# Altium project Logic_RF.PrjPcb
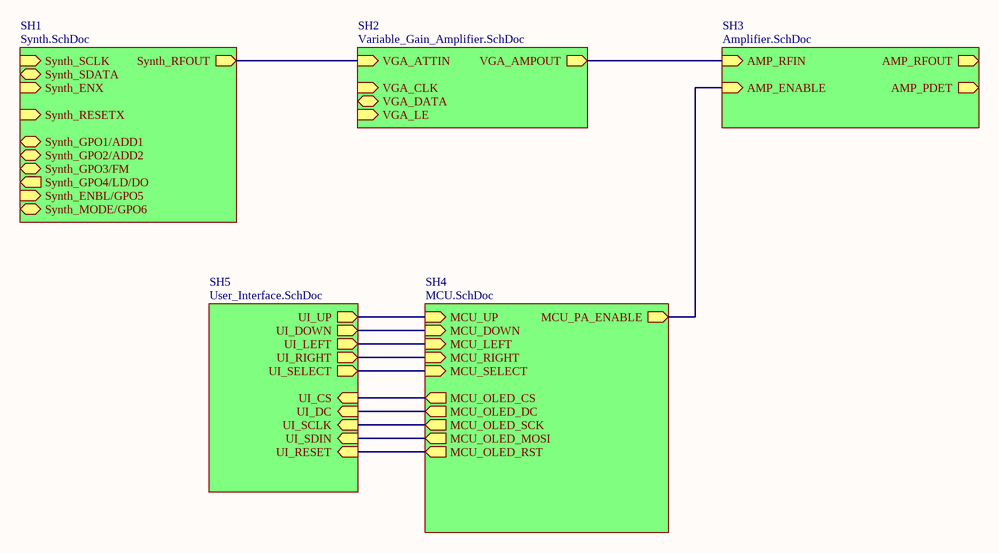
[diagram p0: Top_Level.SchDoc]
5 sheets, 72 parts. Net scope: hierarchical (ports join the sheet entries above them; power ports are global).
Board file: Logic_RF.PcbDoc
Sheets:
  Top_Level.SchDoc
    SH1 = Synth.SchDoc
    SH2 = Variable_Gain_Amplifier.SchDoc
    SH3 = Amplifier.SchDoc
    SH4 = MCU.SchDoc

## Sheet Top_Level.SchDoc: AusBubble : Logic & RF : Top Level
size A4; DrawnBy: WR, ND; DocumentNumber: 1; Revision: A; SheetNumber: 1; SheetTotal: 6

### Sub-sheets
SH1 = Synth.SchDoc: Synth_RESETX (in), Synth_ENX (in), Synth_SCLK (in), Synth_SDATA, Synth_ENBL/GPO5 (in), Synth_GPO4/LD/DO (out), Synth_RFOUT (out), Synth_GPO3/FM (bidir), Synth_GPO1/ADD1 (bidir), Synth_GPO2/ADD2 (bidir), Synth_MODE/GPO6 (bidir)
SH2 = Variable_Gain_Amplifier.SchDoc: VGA_AMPOUT (out), VGA_CLK (in), VGA_DATA, VGA_LE (in), VGA_ATTIN (in)
SH3 = Amplifier.SchDoc: AMP_RFIN (in), AMP_RFOUT (out), AMP_ENABLE (in), AMP_PDET (out)
SH4 = MCU.SchDoc: MCU_UP (in), MCU_DOWN (in), MCU_LEFT (in), MCU_RIGHT (in), MCU_SELECT (in), MCU_PA_ENABLE (out), MCU_OLED_CS (out), MCU_OLED_DC (out), MCU_OLED_RST (out), MCU_OLED_SCK (out), MCU_OLED_MOSI (out)
SH5 = User_Interface.SchDoc (file not in this document): UI_CS (in), UI_DC (in), UI_SCLK (in), UI_SDIN (in), UI_RESET (in), UI_UP (out), UI_DOWN (out), UI_LEFT (out), UI_RIGHT (out), UI_SELECT (out)

### Nets
NetC13_2: sheet SH1/Synth_RFOUT, sheet SH2/VGA_ATTIN
NetC23_1: sheet SH2/VGA_AMPOUT, sheet SH3/AMP_RFIN
NetQ1_2: sheet SH4/MCU_SELECT, sheet SH5/UI_SELECT
NetR19_2: sheet SH3/AMP_ENABLE, sheet SH4/MCU_PA_ENABLE
NetU1_16: sheet SH4/MCU_OLED_DC, sheet SH5/UI_DC
NetU1_17: sheet SH4/MCU_OLED_RST, sheet SH5/UI_RESET
NetU1_20: sheet SH4/MCU_OLED_CS, sheet SH5/UI_CS
NetU1_21: sheet SH4/MCU_OLED_SCK, sheet SH5/UI_SCLK
NetU1_23: sheet SH4/MCU_OLED_MOSI, sheet SH5/UI_SDIN
NetU1_51: sheet SH4/MCU_DOWN, sheet SH5/UI_DOWN
NetU1_52: sheet SH4/MCU_UP, sheet SH5/UI_UP
NetU1_53: sheet SH4/MCU_RIGHT, sheet SH5/UI_RIGHT
NetU1_54: sheet SH4/MCU_LEFT, sheet SH5/UI_LEFT

## Sheet Synth.SchDoc
size A4; DocumentNumber: 3; SheetNumber: 3; SheetTotal: 5
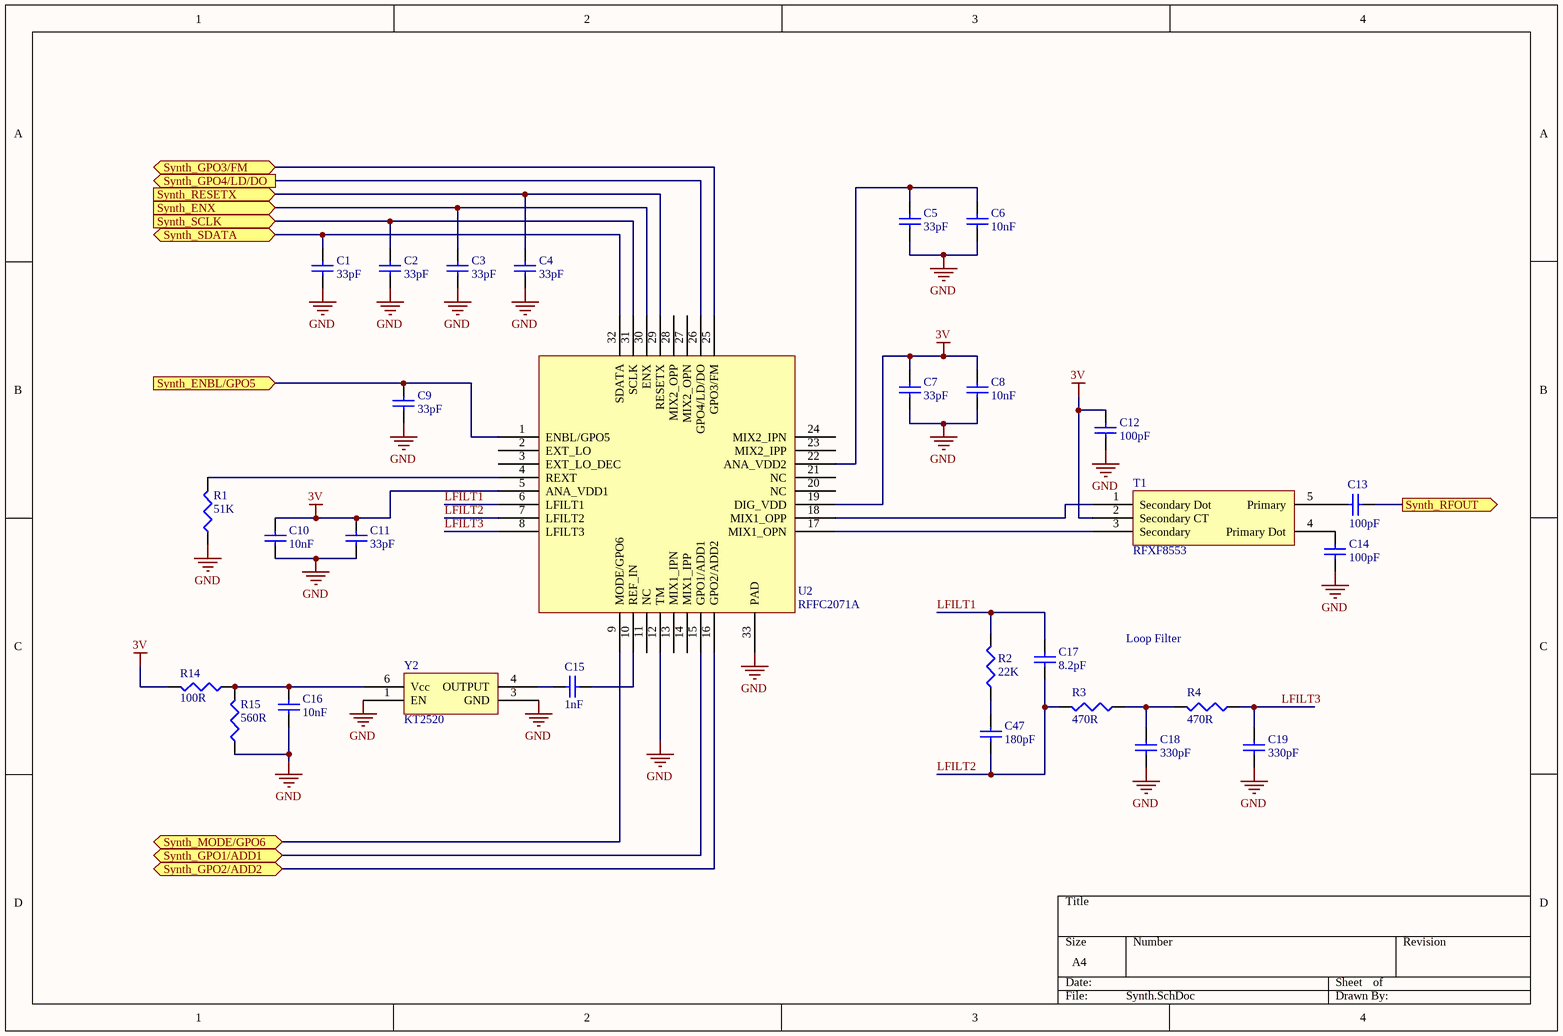
[diagram p1: Synth.SchDoc]

### Parts
C1  value 33pF  [1608[0603]]  (hidden comment: Cap Semi)
C2  value 33pF  [1608[0603]]  (hidden comment: Cap Semi)
C3  value 33pF  [1608[0603]]  (hidden comment: Cap Semi)
C4  value 33pF  [1608[0603]]  (hidden comment: Cap Semi)
C5  value 33pF  [1608[0603]]  (hidden comment: Cap Semi)
C6  value 10nF  [1608[0603]]  (hidden comment: Cap Semi)
C7  value 33pF  [1608[0603]]  (hidden comment: Cap Semi)
C8  value 10nF  [1608[0603]]  (hidden comment: Cap Semi)
C9  value 33pF  [1608[0603]]  (hidden comment: Cap Semi)
C10  value 10nF  [1608[0603]]  (hidden comment: Cap Semi)
C11  value 33pF  [1608[0603]]  (hidden comment: Cap Semi)
C12  value 100pF  [1608[0603]]  (hidden comment: Cap Semi)
C13  value 100pF  [1608[0603]]  (hidden comment: Cap Semi)
C14  value 100pF  [1608[0603]]  (hidden comment: Cap Semi)
C15  value 1nF  [1608[0603]]  (hidden comment: Cap Semi)
C16  value 10nF  [1608[0603]]  (hidden comment: Cap Semi)
C17  value 8.2pF  [1608[0603]]  (hidden comment: Cap Semi)
C18  value 330pF  [1608[0603]]  (hidden comment: Cap Semi)
C19  value 330pF  [1608[0603]]  (hidden comment: Cap Semi)
C47  value 180pF  [1608[0603]]  (hidden comment: Cap Semi)
R1  value 51K  [J1-0603]  (hidden comment: Res3)
R2  value 22K  [J1-0603]  (hidden comment: Res3)
R3  value 470R  [J1-0603]  (hidden comment: Res3)
R4  value 470R  [J1-0603]  (hidden comment: Res3)
R14  value 100R  [J1-0603]  (hidden comment: Res3)
R15  value 560R  [J1-0603]  (hidden comment: Res3)
T1  RFXF8553  [RFXF8553]
U2  RFFC2071A  [QFN50P500X500-32WAL]
Y2  KT2520  [KT2520]

### Ports
Synth_ENBL/GPO5 (in), Synth_ENX (in), Synth_GPO1/ADD1 (bidir), Synth_GPO2/ADD2 (bidir), Synth_GPO3/FM (bidir), Synth_GPO4/LD/DO (out), Synth_MODE/GPO6 (bidir), Synth_RESETX (in), Synth_RFOUT (out), Synth_SCLK (in), Synth_SDATA

### Nets
3V: C7.1 C8.1 C10.2 C11.2 C12.1 R14.2 T1.2(Secondary_CT) U2.5(ANA_VDD1) U2.19(DIG_VDD)
GND: C1.1 C2.1 C3.1 C4.1 C5.2 C6.2 C7.2 C8.2 C9.1 C10.1 C11.1 C12.2 C14.1 C16.1 C18.1 C19.1 R1.1 R15.1 U2.12(TM) U2.33(PAD) Y2.1(EN) Y2.3(GND)
LFILT1: C17.2 R2.2 U2.6(LFILT1)
LFILT2: C17.1 C47.1 R3.2 U2.7(LFILT2)
LFILT3: C19.2 R4.1 U2.8(LFILT3)
NetC1_2: C1.2 U2.32(SDATA) ; port Synth_SDATA
NetC2_2: C2.2 U2.31(SCLK) ; port Synth_SCLK
NetC3_2: C3.2 U2.30(ENX) ; port Synth_ENX
NetC4_2: C4.2 U2.29(RESETX) ; port Synth_RESETX
NetC5_1: C5.1 C6.1 U2.22(ANA_VDD2)
NetC9_2: C9.2 U2.1(ENBL/GPO5) ; port Synth_ENBL/GPO5
NetC13_1: C13.1 T1.5(Primary)
NetC13_2: C13.2 ; port Synth_RFOUT
NetC14_2: C14.2 T1.4(Primary_Dot)
NetC15_1: C15.1 U2.10(REF_IN)
NetC15_2: C15.2 Y2.4(OUTPUT)
NetC16_2: C16.2 R14.1 R15.2 Y2.6(Vcc)
NetC18_2: C18.2 R3.1 R4.2
NetC47_2: C47.2 R2.1
NetR1_2: R1.2 U2.4(REXT)
NetT1_1: T1.1(Secondary_Dot) U2.18(MIX1_OPP)
NetT1_3: T1.3(Secondary) U2.17(MIX1_OPN)
NetU2_9: U2.9(MODE/GPO6) ; port Synth_MODE/GPO6
NetU2_15: U2.15(GPO1/ADD1) ; port Synth_GPO1/ADD1
NetU2_16: U2.16(GPO2/ADD2) ; port Synth_GPO2/ADD2
NetU2_25: U2.25(GPO3/FM) ; port Synth_GPO3/FM
NetU2_26: U2.26(GPO4/LD/DO) ; port Synth_GPO4/LD/DO

Not connected (* = marked no-connect by the designer): U2 2(EXT_LO) 3(EXT_LO_DEC) 11(NC) 13(MIX1_IPN) 14(MIX1_IPP) 20(NC) 21(NC) 23(MIX2_IPP) 24(MIX2_IPN) 27(MIX2_OPN) 28(MIX2_OPP)

### Notes on the sheet
- Loop Filter

### Library data of the parts
C1-C19 C47 = Cap Semi: Capacitor (Semiconductor SIM Model); Published: 8-Jun-2000; LatestRevisionDate: 29-May-2009; LatestRevisionNote: IPC-7351 Footprint Added.; PackageReference: C1206; Publisher: Altium Limited; PackageDescription: Chip Capacitor
R1-R4 R14 R15 = Res3: Resistor; Published: 8-Jun-2000; LatestRevisionDate: 29-May-2009; LatestRevisionNote: IPC-7351 Footprint Added.; PackageReference: J1-0603; Publisher: Altium Limited; PackageDescription: Chip Resistor
T1 = RFXF8553: 1:4 SMT TRANSFORMER
U2 = RFFC2071: 2.7GHz RF SYNTHESIZER/VCO WITH INTEGRATED RF MIXER
Y2 = KT2520: Temperature-Compensated Crystal Oscillator (TCXO) KT2520; Supplier 1: Mouser; Supplier Part Number 1: 581-KT2520P52ECW24TA

## Sheet Variable_Gain_Amplifier.SchDoc
size A4; DocumentNumber: 4; SheetNumber: 4; SheetTotal: 5
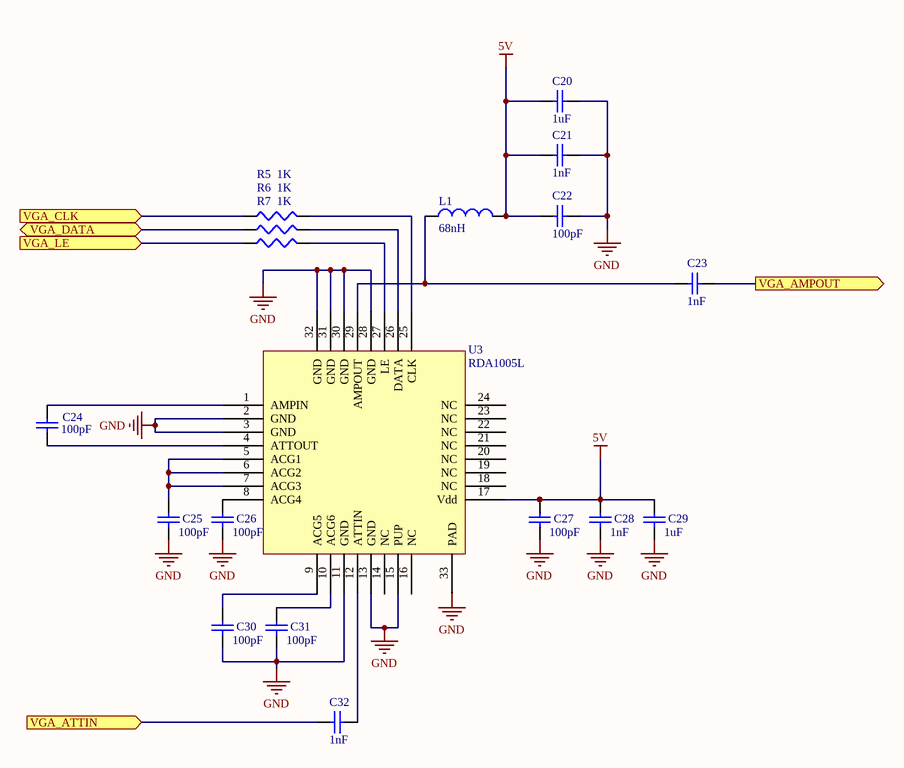
[diagram p2: Variable_Gain_Amplifier.SchDoc]

### Parts
C20  value 1uF  [1608[0603]]  (hidden comment: Cap Semi)
C21  value 1nF  [1608[0603]]  (hidden comment: Cap Semi)
C22  value 100pF  [1608[0603]]  (hidden comment: Cap Semi)
C23  value 1nF  [1608[0603]]  (hidden comment: Cap Semi)
C24  value 100pF  [1608[0603]]  (hidden comment: Cap Semi)
C25  value 100pF  [1608[0603]]  (hidden comment: Cap Semi)
C26  value 100pF  [1608[0603]]  (hidden comment: Cap Semi)
C27  value 100pF  [1608[0603]]  (hidden comment: Cap Semi)
C28  value 1nF  [1608[0603]]  (hidden comment: Cap Semi)
C29  value 1uF  [1608[0603]]  (hidden comment: Cap Semi)
C30  value 100pF  [1608[0603]]  (hidden comment: Cap Semi)
C31  value 100pF  [1608[0603]]  (hidden comment: Cap Semi)
C32  value 1nF  [1608[0603]]  (hidden comment: Cap Semi)
L1  value 68nH  [0603]  (hidden comment: Inductor)
R5  value 1K  [J1-0603]  (hidden comment: Res3)
R6  value 1K  [J1-0603]  (hidden comment: Res3)
R7  value 1K  [J1-0603]  (hidden comment: Res3)
U3  RDA1005L  [QFN50P500X500-32WAL]

### Ports
VGA_AMPOUT (out), VGA_ATTIN (in), VGA_CLK (in), VGA_DATA, VGA_LE (in)

### Nets
5V: C20.2 C21.2 C22.2 C27.2 C28.2 C29.2 L1.2 U3.17(Vdd)
GND: C20.1 C21.1 C22.1 C25.1 C26.1 C27.1 C28.1 C29.1 C30.1 C31.1 U3.2(GND) U3.3(GND) U3.11(GND) U3.13(GND) U3.15(PUP) U3.28(GND) U3.30(GND) U3.31(GND) U3.32(GND) U3.33(PAD)
NetC13_2: C32.2 ; port VGA_ATTIN
NetC23_1: C23.1 ; port VGA_AMPOUT
NetC23_2: C23.2 L1.1 U3.29(AMPOUT)
NetC24_1: C24.1 U3.4(ATTOUT)
NetC24_2: C24.2 U3.1(AMPIN)
NetC25_2: C25.2 U3.5(ACG1) U3.6(ACG2) U3.7(ACG3)
NetC26_2: C26.2 U3.8(ACG4)
NetC30_2: C30.2 U3.9(ACG5)
NetC31_2: C31.2 U3.10(ACG6)
NetC32_1: C32.1 U3.12(ATTIN)
NetR5_1: R5.1 ; port VGA_CLK
NetR5_2: R5.2 U3.25(CLK)
NetR6_1: R6.1 ; port VGA_DATA
NetR6_2: R6.2 U3.26(DATA)
NetR7_1: R7.1 ; port VGA_LE
NetR7_2: R7.2 U3.27(LE)

Not connected (* = marked no-connect by the designer): U3 14(NC) 16(NC) 18(NC) 19(NC) 20(NC) 21(NC) 22(NC) 23(NC) 24(NC)

### Library data of the parts
C20-C32 = Cap Semi: Capacitor (Semiconductor SIM Model); Published: 8-Jun-2000; LatestRevisionDate: 29-May-2009; LatestRevisionNote: IPC-7351 Footprint Added.; PackageReference: C1206; Publisher: Altium Limited; PackageDescription: Chip Capacitor
L1 = Inductor: Code_IEC: 1005; Published: 8-Jun-2000; LatestRevisionDate: 29-May-2009; LatestRevisionNote: IPC-7351 Footprint Added.; PackageReference: 0402-A; Publisher: Altium Limited; PackageDescription: Chip Inductor; Code_JEITA: 0402
R5-R7 = Res3: Resistor; Published: 8-Jun-2000; LatestRevisionDate: 29-May-2009; LatestRevisionNote: IPC-7351 Footprint Added.; PackageReference: J1-0603; Publisher: Altium Limited; PackageDescription: Chip Resistor
U3 = RDA1005L: DIGITAL CONTROLLED VARIABLE GAIN  AMPLIFIER 50 MHZ TO 4000 MHZ, 6 BIT

## Sheet Amplifier.SchDoc: AusBubble : Logic & RF : Amplifier
size A4; DrawnBy: WR, ND; DocumentNumber: 5; Revision: A; SheetNumber: 5; SheetTotal: 6
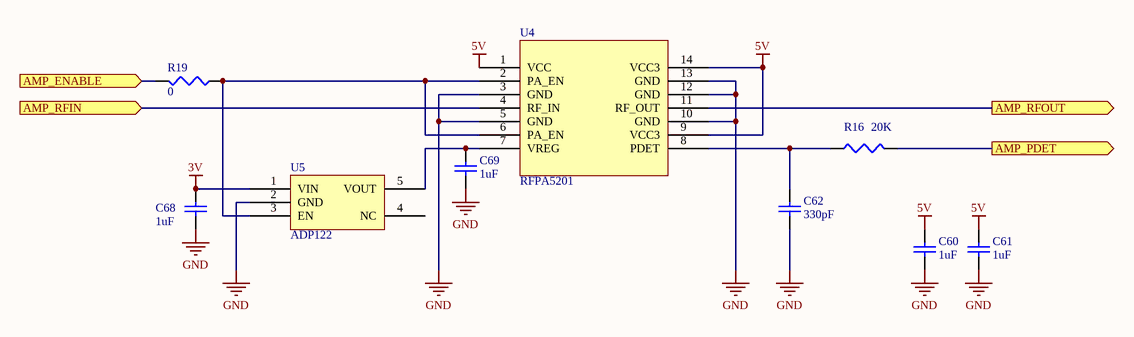
[diagram p3: Amplifier.SchDoc]

### Parts
C60  value 1uF  [1608[0603]]  (hidden comment: Cap Semi)
C61  value 1uF  [1608[0603]]  (hidden comment: Cap Semi)
C62  value 330pF  [1608[0603]]  (hidden comment: Cap Semi)
C68  value 1uF  [1608[0603]]  (hidden comment: Cap Semi)
C69  value 1uF  [1608[0603]]  (hidden comment: Cap Semi)
R16  value 20K  [J1-0603]  (hidden comment: Res3)
R19  value 0  [J1-0603]  (hidden comment: Res3)  (no BOM)
U4  RFPA5201  [MCM14]
U5  ADP122  [SOT23-5AM]

### Ports
AMP_ENABLE (in), AMP_PDET (out), AMP_RFIN (in), AMP_RFOUT (out)

### Nets
3V: C68.2 U5.1(VIN)
5V: C60.2 C61.2 U4.1(VCC) U4.9(VCC3) U4.14(VCC3)
GND: C60.1 C61.1 C62.1 C68.1 C69.1 U4.3(GND) U4.5(GND) U4.10(GND) U4.12(GND) U4.13(GND) U5.2(GND)
NetC23_1: U4.4(RF_IN) ; port AMP_RFIN
NetC62_2: C62.2 R16.1 U4.8(PDET)
NetC69_2: C69.2 U4.7(VREG) U5.5(VOUT)
NetR16_2: R16.2 ; port AMP_PDET
NetR19_1: R19.1 U4.2(PA_EN) U4.6(PA_EN) U5.3(EN)
NetR19_2: R19.2 ; port AMP_ENABLE
NetU4_11: U4.11(RF_OUT) ; port AMP_RFOUT

Not connected (* = marked no-connect by the designer): U5 4(NC)

### Library data of the parts
C60-C62 C68 C69 = Cap Semi: Capacitor (Semiconductor SIM Model); Published: 8-Jun-2000; LatestRevisionDate: 29-May-2009; LatestRevisionNote: IPC-7351 Footprint Added.; PackageReference: C1206; Publisher: Altium Limited; PackageDescription: Chip Capacitor
R16 R19 = Res3: Resistor; Published: 8-Jun-2000; LatestRevisionDate: 29-May-2009; LatestRevisionNote: IPC-7351 Footprint Added.; PackageReference: J1-0603; Publisher: Altium Limited; PackageDescription: Chip Resistor
U4 = RFPA5201: WiFi Power Amplifier Module
U5 = ADP122: 2.9V LDO

## Sheet MCU.SchDoc: AusBubble : Logic & RF : MCU
size A3; DrawnBy: WR, ND; DocumentNumber: 2; Revision: A; SheetNumber: 2; SheetTotal: 5
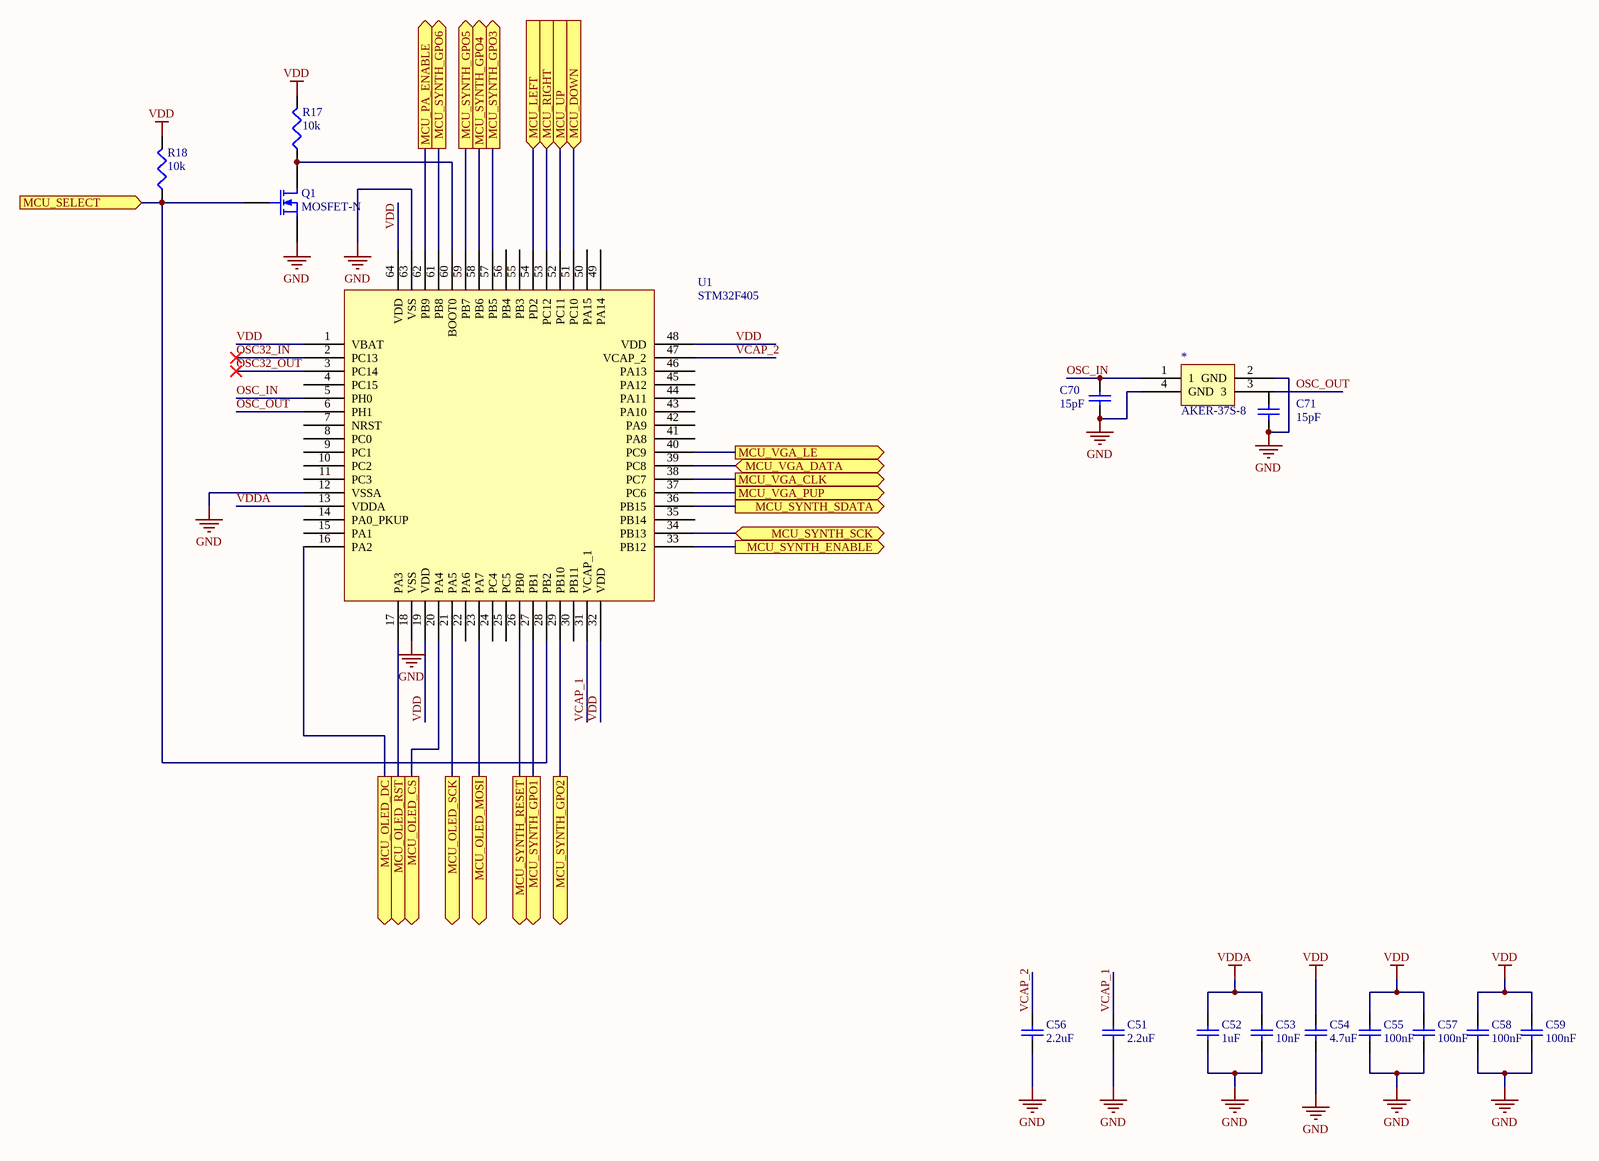
[diagram p4: MCU.SchDoc]

### Parts
*  AKER-37S-8  [AKER-37S]
C51  value 2.2uF  [1608[0603]]  (hidden comment: Cap Semi)
C52  value 1uF  [1608[0603]]  (hidden comment: Cap Semi)
C53  value 10nF  [1608[0603]]  (hidden comment: Cap Semi)
C54  value 4.7uF  [1608[0603]]  (hidden comment: Cap Semi)
C55  value 100nF  [1608[0603]]  (hidden comment: Cap Semi)
C56  value 2.2uF  [1608[0603]]  (hidden comment: Cap Semi)
C57  value 100nF  [1608[0603]]  (hidden comment: Cap Semi)
C58  value 100nF  [1608[0603]]  (hidden comment: Cap Semi)
C59  value 100nF  [1608[0603]]  (hidden comment: Cap Semi)
C70  value 15pF  [0402]  (hidden comment: Cap Semi)
C71  value 15pF  [0402]  (hidden comment: Cap Semi)
Q1  MOSFET-N  [SOT95P230-3M]
R17  value 10k  [J1-0603]  (hidden comment: Res3)
R18  value 10k  [J1-0603]  (hidden comment: Res3)
U1  STM32F405  [SQFP50P1200X1200-64L]

### Ports
MCU_DOWN (in), MCU_LEFT (in), MCU_OLED_CS (out), MCU_OLED_DC (out), MCU_OLED_MOSI (out), MCU_OLED_RST (out), MCU_OLED_SCK (out), MCU_PA_ENABLE (out), MCU_RIGHT (in), MCU_SELECT (in), MCU_SYNTH_ENABLE (out), MCU_SYNTH_GPO1 (out), MCU_SYNTH_GPO2 (out), MCU_SYNTH_GPO3 (out), MCU_SYNTH_GPO4 (out), MCU_SYNTH_GPO5 (out), MCU_SYNTH_GPO6 (out), MCU_SYNTH_RESET (out), MCU_SYNTH_SCK (bidir), MCU_SYNTH_SDATA (out), MCU_UP (in), MCU_VGA_CLK (out), MCU_VGA_DATA (bidir), MCU_VGA_LE (out), MCU_VGA_PUP (out)

### Nets
GND: *.2(GND) *.4(GND) C51.1 C52.1 C53.1 C54.1 C55.1 C56.1 C57.1 C58.1 C59.1 C70.1 C71.1 Q1.3(S) U1.12(VSSA) U1.18(VSS) U1.63(VSS)
VDD: C54.2 C55.2 C57.2 C58.2 C59.2 R17.2 R18.2 U1.1(VBAT) U1.19(VDD) U1.32(VDD) U1.48(VDD) U1.64(VDD)
VDDA: C52.2 C53.2 U1.13(VDDA)
OSC32_IN: U1.2(PC13)
OSC32_OUT: U1.3(PC14)
OSC_IN: *.1 C70.2 U1.5(PH0)
OSC_OUT: *.3 U1.6(PH1)
VCAP_1: C51.2 U1.31(VCAP_1)
VCAP_2: C56.2 U1.47(VCAP_2)
NetQ1_1: Q1.1(D) R17.1 U1.60(BOOT0)
NetQ1_2: Q1.2(G) R18.1 U1.28(PB2) ; port MCU_SELECT
NetR19_2: U1.62(PB9) ; port MCU_PA_ENABLE
NetU1_16: U1.16(PA2) ; port MCU_OLED_DC
NetU1_17: U1.17(PA3) ; port MCU_OLED_RST
NetU1_20: U1.20(PA4) ; port MCU_OLED_CS
NetU1_21: U1.21(PA5) ; port MCU_OLED_SCK
NetU1_23: U1.23(PA7) ; port MCU_OLED_MOSI
NetU1_26: U1.26(PB0) ; port MCU_SYNTH_RESET
NetU1_27: U1.27(PB1) ; port MCU_SYNTH_GPO1
NetU1_29: U1.29(PB10) ; port MCU_SYNTH_GPO2
NetU1_33: U1.33(PB12) ; port MCU_SYNTH_ENABLE
NetU1_34: U1.34(PB13) ; port MCU_SYNTH_SCK
NetU1_36: U1.36(PB15) ; port MCU_SYNTH_SDATA
NetU1_37: U1.37(PC6) ; port MCU_VGA_PUP
NetU1_38: U1.38(PC7) ; port MCU_VGA_CLK
NetU1_39: U1.39(PC8) ; port MCU_VGA_DATA
NetU1_40: U1.40(PC9) ; port MCU_VGA_LE
NetU1_51: U1.51(PC10) ; port MCU_DOWN
NetU1_52: U1.52(PC11) ; port MCU_UP
NetU1_53: U1.53(PC12) ; port MCU_RIGHT
NetU1_54: U1.54(PD2) ; port MCU_LEFT
NetU1_57: U1.57(PB5) ; port MCU_SYNTH_GPO3
NetU1_58: U1.58(PB6) ; port MCU_SYNTH_GPO4
NetU1_59: U1.59(PB7) ; port MCU_SYNTH_GPO5
NetU1_61: U1.61(PB8) ; port MCU_SYNTH_GPO6

Not connected (* = marked no-connect by the designer): C71 2; U1 4(PC15) 7(NRST) 8(PC0) 9(PC1) 10(PC2) 11(PC3) 14(PA0_PKUP) 15(PA1) 22(PA6) 24(PC4) 25(PC5) 30(PB11) 35(PB14) 41(PA8) 42(PA9) 43(PA10) 44(PA11) 45(PA12) 46(PA13) 49(PA14) 50(PA15) 55(PB3) 56(PB4)

### Library data of the parts
C51-C59 C70 C71 = Cap Semi: Capacitor (Semiconductor SIM Model); Published: 8-Jun-2000; LatestRevisionDate: 29-May-2009; LatestRevisionNote: IPC-7351 Footprint Added.; PackageReference: C1206; Publisher: Altium Limited; PackageDescription: Chip Capacitor
Q1 = MOSFET-N: N-Channel MOSFET; Published: 8-Jun-2000; LatestRevisionDate: 17-Jul-2002; LatestRevisionNote: Re-released for DXP Platform.; PackageVersion: 1995/1996; PackageReference: E3; Publisher: Altium Limited; PackageDescription: TO, Flat Index; 3 In-Line, Axial Leads; Body Dia. 4.6mm; Lead Dia. 0.5 mm (max)
R17 R18 = Res3: Resistor; Published: 8-Jun-2000; LatestRevisionDate: 29-May-2009; LatestRevisionNote: IPC-7351 Footprint Added.; PackageReference: J1-0603; Publisher: Altium Limited; PackageDescription: Chip Resistor
U1 = STM32F405RG: ARM Cortex-M4 32 bit Microprocessor

## Nets that join several sheets
3V: Synth (9 pins), Amplifier (C68.2 U5.1)
5V: Variable_Gain_Amplifier (8 pins), Amplifier (5 pins)
GND: Synth (22 pins), Variable_Gain_Amplifier (20 pins), Amplifier (11 pins), MCU (17 pins)
NetC13_2: Synth (C13.2), Variable_Gain_Amplifier (C32.2)
NetC23_1: Variable_Gain_Amplifier (C23.1), Amplifier (U4.4)
NetR19_2: Amplifier (R19.2), MCU (U1.62)